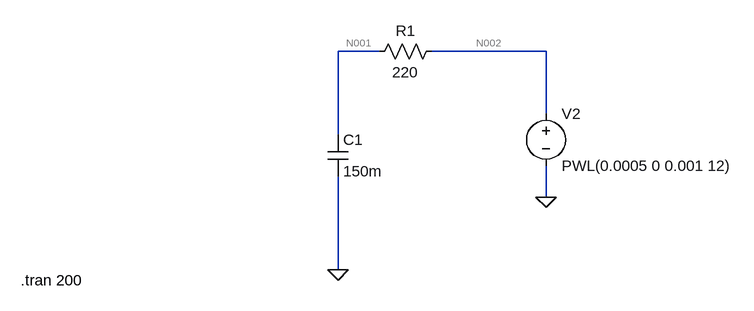
[diagram p0: schematic Moc_tracona_na_rezystorze.asc]
Moc_tracona_na_rezystorze.asc, the LTspice schematic file:
Version 4.1
SHEET 1 1168 680
WIRE 352 48 288 48
WIRE 608 48 432 48
WIRE 608 144 608 48
WIRE 288 176 288 48
WIRE 608 272 608 224
WIRE 288 384 288 240
FLAG 288 384 0
FLAG 608 272 0
SYMBOL cap 272 176 R0
SYMATTR InstName C1
SYMATTR Value 150m
SYMATTR SpiceLine Rser=6464m
SYMBOL res 448 32 R90
WINDOW 0 0 56 VBottom 2
WINDOW 3 32 56 VTop 2
SYMATTR InstName R1
SYMATTR Value 220
SYMBOL voltage 608 128 R0
WINDOW 123 0 0 Left 0
WINDOW 39 0 0 Left 0
SYMATTR InstName V2
SYMATTR Value PWL(0.0005 0 0.001 12)
TEXT -200 400 Left 2 !.tran 200

The netlist it stands for:
* Moc_tracona_na_rezystorze.asc
C1 N001 0 150m Rser=6464m
R1 N002 N001 220
V2 N002 0 PWL(0.0005 0 0.001 12)
.tran 200
.backanno
.end

* Results of the author's LTspice run, read from the files saved beside the schematic
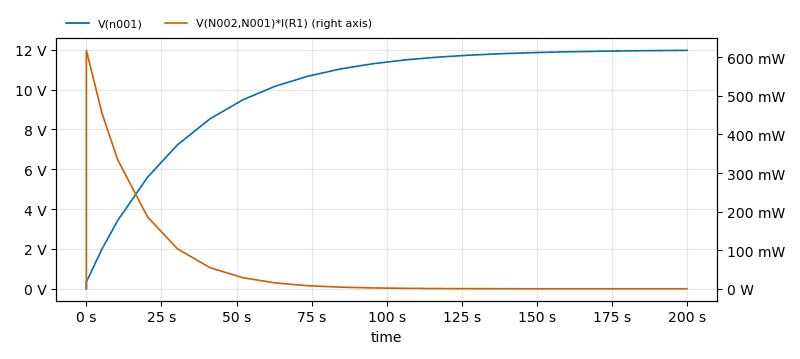
[diagram p1: Transient Analysis of Moc_tracona_na_rezystorze.asc, plotted from the saved traces]
* Transient Analysis, 1 run:
*   V(n001): min 0 V, max 11.97 V, average 10.01 V, rms 10.4 V, last 11.97 V
*   V(N002,N001)*I(R1): min 0 W, max 617.7 mW, average 53.5 mW, rms 130.8 mW, last 4.752 µW